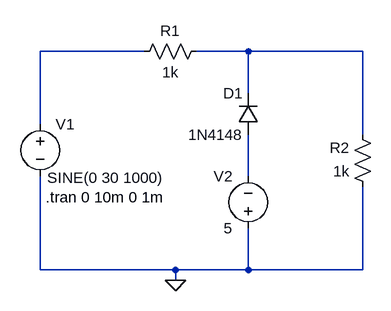
[diagram p0: schematic Negative Biased Clipper.asc]
Negative Biased Clipper.asc, the LTspice schematic file:
Version 4
SHEET 1 880 680
WIRE 352 176 192 176
WIRE 512 176 432 176
WIRE 688 176 512 176
WIRE 512 240 512 176
WIRE 192 288 192 176
WIRE 688 304 688 176
WIRE 512 368 512 304
WIRE 192 512 192 368
WIRE 400 512 192 512
WIRE 512 512 512 448
WIRE 512 512 400 512
WIRE 688 512 688 384
WIRE 688 512 512 512
WIRE 400 528 400 512
FLAG 400 528 0
SYMBOL res 448 160 R90
WINDOW 0 0 56 VBottom 2
WINDOW 3 32 56 VTop 2
SYMATTR InstName R1
SYMATTR Value 1k
SYMBOL diode 528 304 R180
WINDOW 0 24 64 Left 2
WINDOW 3 24 0 Left 2
SYMATTR InstName D1
SYMATTR Value 1N4148
SYMBOL voltage 192 272 R0
WINDOW 3 11 98 Left 2
SYMATTR Value SINE(0 30 1000)
SYMATTR InstName V1
SYMBOL voltage 512 464 R180
WINDOW 0 24 96 Left 2
WINDOW 3 24 16 Left 2
SYMATTR InstName V2
SYMATTR Value 5
SYMBOL res 704 400 R180
WINDOW 0 36 76 Left 2
WINDOW 3 36 40 Left 2
SYMATTR InstName R2
SYMATTR Value 1k
TEXT 200 400 Left 2 !.tran 0 10m 0 1m

The netlist it stands for:
* Negative Biased Clipper.asc
R1 N002 N001 1k
D1 N003 N002 1N4148
V1 N001 0 SINE(0 30 1000)
V2 0 N003 5
R2 0 N002 1k
.model D D
.lib standard.dio
.tran 0 10m 0 1m
.backanno
.end